# EAGLE design Sensoray_Breakout (EAGLE 7.1.0)
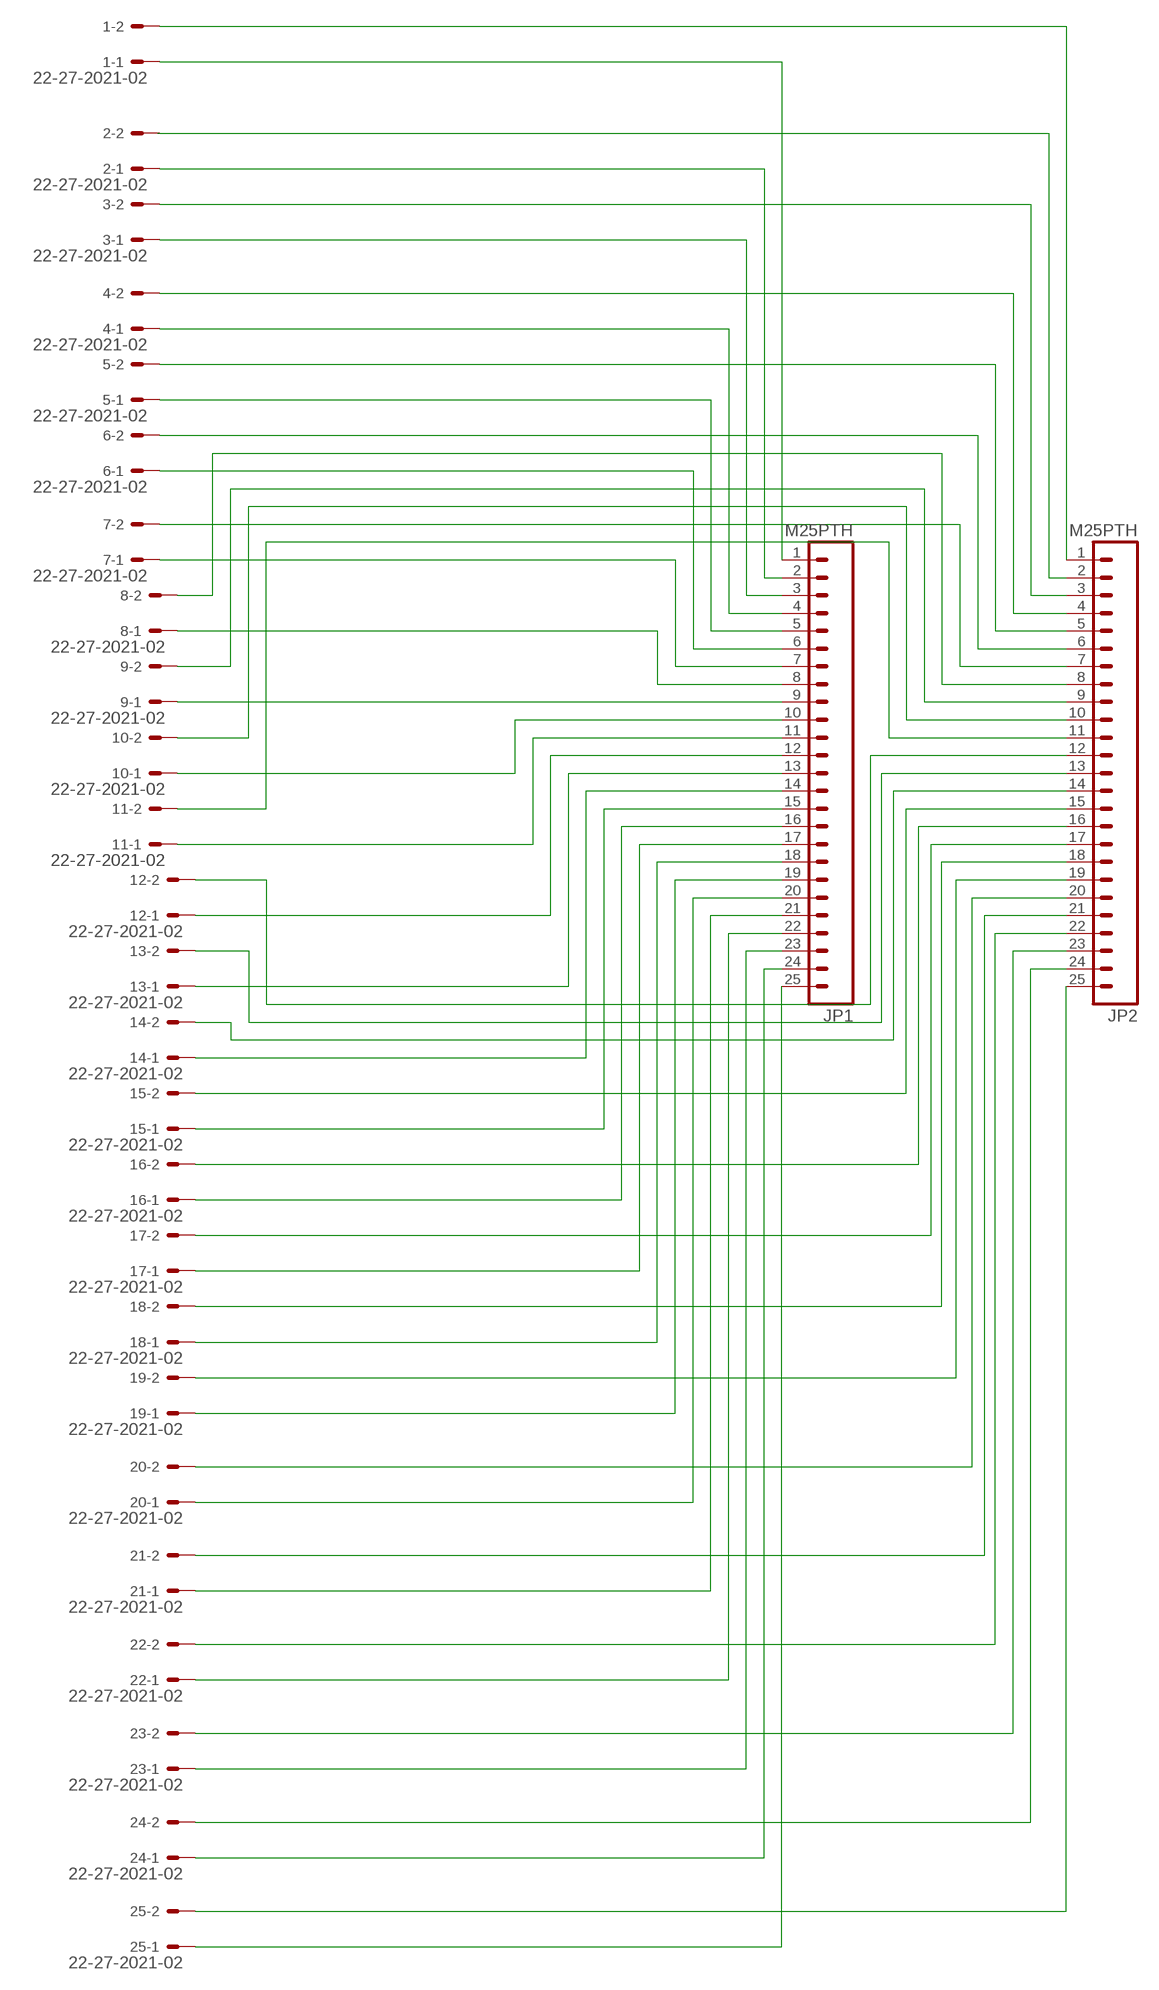
[diagram p0: schematic, sheet 1]

## Parts
1  22-27-2021-02  [6410-02]
2  22-27-2021-02  [6410-02]
3  22-27-2021-02  [6410-02]
4  22-27-2021-02  [6410-02]
5  22-27-2021-02  [6410-02]
6  22-27-2021-02  [6410-02]
7  22-27-2021-02  [6410-02]
8  22-27-2021-02  [6410-02]
9  22-27-2021-02  [6410-02]
10  22-27-2021-02  [6410-02]
11  22-27-2021-02  [6410-02]
12  22-27-2021-02  [6410-02]
13  22-27-2021-02  [6410-02]
14  22-27-2021-02  [6410-02]
15  22-27-2021-02  [6410-02]
16  22-27-2021-02  [6410-02]
17  22-27-2021-02  [6410-02]
18  22-27-2021-02  [6410-02]
19  22-27-2021-02  [6410-02]
20  22-27-2021-02  [6410-02]
21  22-27-2021-02  [6410-02]
22  22-27-2021-02  [6410-02]
23  22-27-2021-02  [6410-02]
24  22-27-2021-02  [6410-02]
25  22-27-2021-02  [6410-02]
JP1  M25PTH  [1X25]
JP2  M25PTH  [1X25]

## Nets
N$1: 1.1 JP1.1
N$2: 2.1 JP1.2
N$3: 2.2 JP2.2
N$4: 3.1 JP1.3
N$5: 4.1 JP1.4
N$6: 5.1 JP1.5
N$7: 6.1 JP1.6
N$8: 7.1 JP1.7
N$9: 8.1 JP1.8
N$10: 9.1 JP1.9
N$11: 25.1 JP1.25
N$12: 24.1 JP1.24
N$13: 23.1 JP1.23
N$14: 22.1 JP1.22
N$15: 21.1 JP1.21
N$16: 20.1 JP1.20
N$17: 19.1 JP1.19
N$18: 18.1 JP1.18
N$19: 17.1 JP1.17
N$20: 16.1 JP1.16
N$21: 15.1 JP1.15
N$22: 14.1 JP1.14
N$23: 13.1 JP1.13
N$24: 12.1 JP1.12
N$25: 11.1 JP1.11
N$26: 10.1 JP1.10
N$27: 1.2 JP2.1
N$28: 3.2 JP2.3
N$29: 4.2 JP2.4
N$30: 5.2 JP2.5
N$31: 6.2 JP2.6
N$32: 7.2 JP2.7
N$33: 8.2 JP2.8
N$34: 9.2 JP2.9
N$35: 10.2 JP2.10
N$36: 11.2 JP2.11
N$37: 12.2 JP2.12
N$38: 13.2 JP2.13
N$39: 14.2 JP2.14
N$40: 15.2 JP2.15
N$41: 16.2 JP2.16
N$42: 17.2 JP2.17
N$43: 18.2 JP2.18
N$44: 19.2 JP2.19
N$45: 20.2 JP2.20
N$46: 21.2 JP2.21
N$47: 22.2 JP2.22
N$48: 23.2 JP2.23
N$49: 24.2 JP2.24
N$50: 25.2 JP2.25

## Library data of the parts
1-25 = con-molex:22-?-02: CONNECTOR wire to board 2.54 mm (.1 inch) pitch header; OC_FARNELL: unknown; OC_NEWARK: unknown
JP1 JP2 = SparkFun-Connectors:M25: 1x25 .1" header

## Board
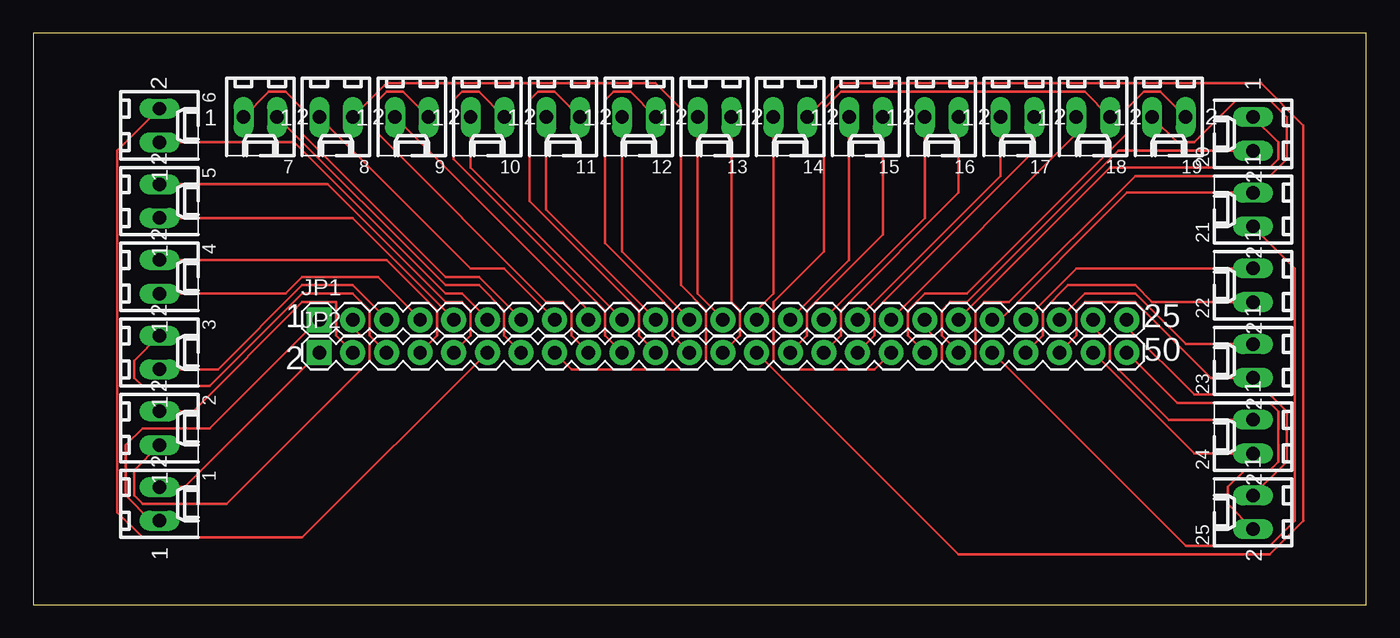
[diagram p1: board, top side]

Size 100.64 x 43.17 mm. Coordinates in mm from the lower left corner, seen from the top.
Outline: 0,0 100.64,0 100.64,43.17 0,43.17 0,0
Copper layers (1*16): Top 0.0178mm / dielectric 59mil / Bottom 0.0178mm
Design rules "epl-lpkf": minimum track width 8mil, minimum drill 0.35mm, track to track 8mil, track to pad 8mil, pad to pad 8mil, via to via 8mil, smd to smd 8mil, copper to edge 15mil, drill to drill 15mil, minimum pad ring 8mil, minimum via ring 8mil, stop-mask expansion 3mil, vias tented up to drill 0mil, thermal gap 10mil

### Footprints (pad centres in the part's own frame; a part is rotated, then mirrored left to right if it is on the bottom)
6410-02 = drill 1.016 long: 1 1.27,0; 2 -1.27,0
1X25 = drill 1.016 pad 1.88 square: 1 0,0 | drill 1.016 pad 1.88: 2 2.54,0; 3 5.08,0; 4 7.62,0; 5 10.16,0; 6 12.7,0; 7 15.24,0; 8 17.78,0; 9 20.32,0; 10 22.86,0; 11 25.4,0; 12 27.94,0; 13 30.48,0; 14 33.02,0; 15 35.56,0; 16 38.1,0; 17 40.64,0; 18 43.18,0; 19 45.72,0; 20 48.26,0; 21 50.8,0; 22 53.34,0; 23 55.88,0; 24 58.42,0; 25 60.96,0

### Placement (x,y rotation side)
1  9.53,7.62 270 top
2  9.53,13.34 270 top
3  9.53,19.05 270 top
4  9.53,24.77 270 top
5  9.53,30.48 270 top
6  9.53,36.2 270 top
7  17.14,36.83 180 top
8  22.86,36.83 180 top
9  28.57,36.83 180 top
10  34.29,36.83 180 top
11  40.01,36.83 180 top
12  45.72,36.83 180 top
13  51.44,36.83 180 top
14  57.15,36.83 180 top
15  62.87,36.83 180 top
16  68.58,36.83 180 top
17  74.3,36.83 180 top
18  80.01,36.83 180 top
19  85.72,36.83 180 top
20  92.08,35.56 90 top
21  92.08,29.84 90 top
22  92.08,24.13 90 top
23  92.08,18.41 90 top
24  92.08,12.7 90 top
25  92.08,6.99 90 top
JP1  21.59,21.51 0 top
JP2  21.59,19.05 0 top

### Tracks (layer width: path | path; a pad name or v marks a point on that pad's centre or on a via)
N$1
  Top 0.203: 1.1 8.89,6.35 6.99,8.26 6.99,12.06 8.26,13.34 13.34,13.34 21.59,21.59 JP1.1
N$2
  Top 0.203: 2.1 7.62,10.16 7.62,8.26 8.26,7.62 14.61,7.62 25.4,18.41 25.4,19.68 24.13,20.95 JP1.2
N$3
  Top 0.203: 2.2 12.06,14.61 20.32,22.86 22.86,22.86 22.86,20.32 JP2.2
N$4
  Top 0.203: 3.1 13.97,17.78 20.32,24.13 24.13,24.13 26.67,21.59 JP1.3
N$5
  Top 0.203: 4.1 19.05,23.5 20.32,24.77 26.04,24.77 29.21,21.59 JP1.4
N$6
  Top 0.203: 5.1 24.13,29.21 31.75,21.59 JP1.5
N$7
  Top 0.203: 6.1 19.68,34.92 31.11,23.5 32.38,23.5 34.29,21.59 JP1.6
N$8
  Top 0.203: 7.1 17.78,38.73 19.05,38.73 20.32,37.47 20.32,35.56 31.11,24.77 33.66,24.77 36.83,21.59 JP1.7
N$9
  Top 0.203: 8.1 33.02,25.4 35.56,25.4 39.37,21.59 JP1.8
N$10
  Top 0.203: 9.1 41.91,22.23 JP1.9
N$11
  Top 0.203: 25.1 94.61,10.79 94.61,14.61 93.34,15.88 87.63,15.88 82.55,20.95 JP1.25
N$12
  Top 0.203: 24.1 85.72,13.97 81.28,18.41 81.28,19.68 80.01,20.95 JP1.24
N$13
  Top 0.203: 23.1 87,19.68 83.19,23.5 79.38,23.5 77.47,21.59 JP1.23
N$14
  Top 0.203: 22.1 78.74,25.4 74.93,21.59 JP1.22
N$15
  Top 0.203: 21.1 82.55,31.11 72.39,20.95 JP1.21
N$16
  Top 0.203: 20.1 93.98,34.92 93.98,33.66 93.34,33.02 81.28,33.02 69.85,21.59 JP1.20
N$17
  Top 0.203: 19.1 86.36,34.92 87.63,34.92 90.81,38.1 93.34,38.1 94.61,36.83 94.61,33.66 93.34,32.38 83.19,32.38 73.66,22.86 71.75,22.86 71.12,22.23 71.12,18.41 70.48,17.78 69.22,17.78 68.58,18.41 68.58,19.68 67.31,20.95 JP1.19
N$18
  Top 0.203: 18.1 78.74,35.56 64.77,21.59 JP1.18
N$19
  Top 0.203: 17.1 73.03,32.38 62.23,21.59 JP1.17
N$20
  Top 0.203: 16.1 67.31,29.21 59.69,21.59 JP1.16
N$21
  Top 0.203: 15.1 61.59,26.04 57.15,21.59 JP1.15
N$22
  Top 0.203: 14.1 55.88,23.5 54.61,22.23 JP1.14
N$23
  Top 0.203: 13.1 50.16,23.5 52.07,21.59 JP1.13
N$24
  Top 0.203: 12.1 44.45,26.67 49.53,21.59 JP1.12
N$25
  Top 0.203: 11.1 38.73,29.84 46.99,21.59 JP1.11
N$26
  Top 0.203: 10.1 33.02,33.02 44.45,21.59 JP1.10
N$27
  Top 0.203: 1.2 11.43,8.89 JP2.1
N$28
  Top 0.203: 3.2 7.62,18.41 7.62,17.14 8.26,16.51 13.34,16.51 20.32,23.5 24.13,23.5 25.4,22.23 25.4,20.32 JP2.3
N$29
  Top 0.203: 4.2 26.67,26.04 30.48,22.23 30.48,20.32 JP2.4
N$30
  Top 0.203: 5.2 22.23,31.75 31.11,22.86 32.38,22.86 33.02,22.23 33.02,20.32 JP2.5
N$31
  Top 0.203: 6.2 6.35,34.29 6.35,6.99 8.26,5.08 20.32,5.08 JP2.6
N$32
  Top 0.203: 7.2 31.11,24.13 33.66,24.13 35.56,22.23 35.56,20.32 JP2.7
N$33
  Top 0.203: 8.2 26.67,39.37 46.99,39.37 48.9,37.47 48.9,24.13 50.8,22.23 50.8,18.41 50.16,17.78 40.64,17.78 JP2.8
N$34
  Top 0.203: 9.2 27.94,38.73 26.67,38.73 26.04,38.1 26.04,35.56 38.73,22.86 40.01,22.86 40.64,22.23 40.64,20.32 JP2.9
N$35
  Top 0.203: 10.2 33.66,38.73 32.38,38.73 31.75,38.1 31.75,33.66 43.18,22.23 43.18,20.32 JP2.10
N$36
  Top 0.203: 11.2 39.37,38.73 38.1,38.73 37.47,38.1 37.47,30.48 45.72,22.23 45.72,20.32 JP2.11
N$37
  Top 0.203: 12.2 45.09,38.73 43.81,38.73 43.18,38.1 43.18,27.3 48.26,22.23 48.26,20.32 JP2.12
N$38
  Top 0.203: 13.2 52.7,22.86 53.34,22.23 53.34,20.32 JP2.13
N$39
  Top 0.203: 14.2 60.96,39.37 92.71,39.37 95.89,36.2 95.89,6.35 93.34,3.81 69.85,3.81 JP2.14
N$40
  Top 0.203: 15.2 64.14,27.94 58.42,22.23 58.42,20.32 JP2.15
N$41
  Top 0.203: 16.2 69.85,31.11 60.96,22.23 60.96,20.32 JP2.16
N$42
  Top 0.203: 17.2 75.56,34.29 63.5,22.23 63.5,20.32 JP2.17
N$43
  Top 0.203: 18.2 79.38,38.73 60.96,38.73 59.69,37.47 59.69,26.67 55.88,22.86 55.88,18.41 56.52,17.78 63.5,17.78 JP2.18
N$44
  Top 0.203: 19.2 85.09,38.73 83.82,38.73 82.55,37.47 82.55,35.56 70.48,23.5 67.31,23.5 66.04,22.23 66.04,20.32 JP2.19
N$45
  Top 0.203: 20.2 81.92,34.29 70.48,22.86 69.22,22.86 68.58,22.23 68.58,20.32 JP2.20
N$46
  Top 0.203: 21.2 95.25,25.4 95.25,6.35 93.34,4.45 87,4.45 JP2.21
N$47
  Top 0.203: 22.2 84.45,22.86 83.19,24.13 78.11,24.13 76.2,22.23 76.2,20.32 JP2.22
N$48
  Top 0.203: 23.2 88.9,17.14 83.19,22.86 79.38,22.86 78.74,22.23 78.74,20.32 JP2.23
N$49
  Top 0.203: 24.2 87.63,11.43 JP2.24
N$50
  Top 0.203: 25.2 90.17,7.62 90.17,8.89 91.44,10.16 93.34,10.16 93.98,10.79 93.98,14.61 93.34,15.24 86.36,15.24 JP2.25

### Text on the board
tSilk: 1 | 25 | 2 | 50